# Altium schematic sheet DC-DC_Protection.SchDoc
size A4
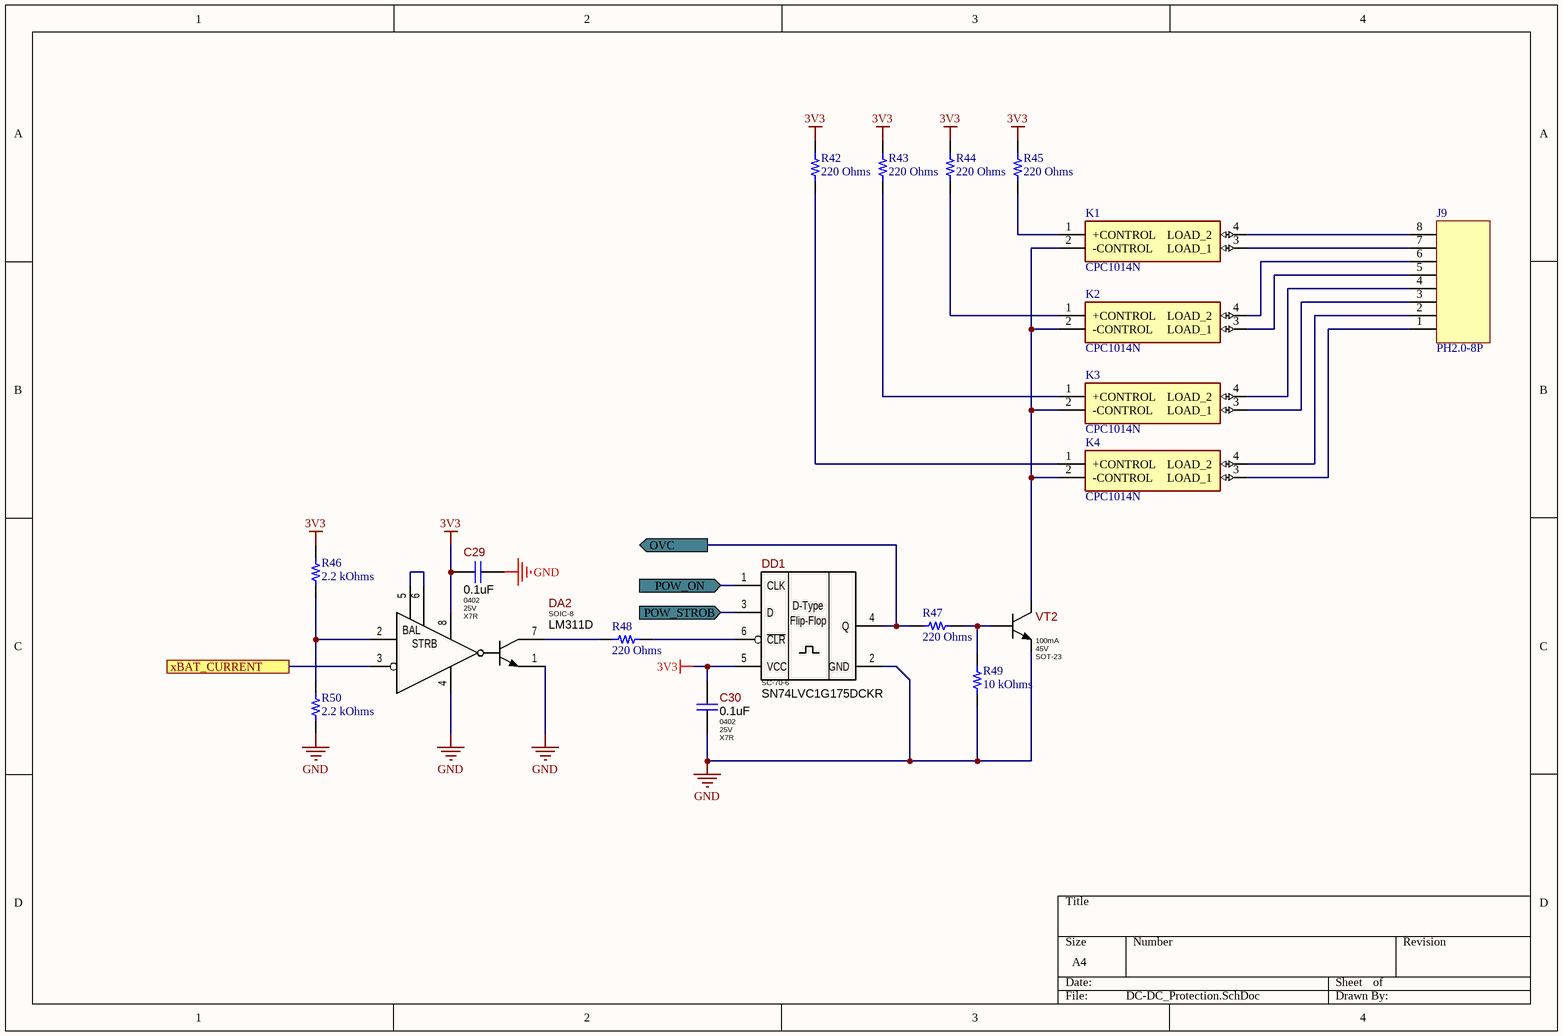
[diagram p0: DC-DC_Protection.SchDoc]

## Parts
C29  Package: 0402  Voltage: 25V  Dielectric Type: X7R  [C_CERAMIC_0402_MED]  (hidden comment: 0.1uF)
C30  Package: 0402  Voltage: 25V  Dielectric Type: X7R  [C_CERAMIC_0402_MED]  (hidden comment: 0.1uF)
DA2  Package: SOIC-8  [SOIC-8_W3.9MM]  (hidden comment: LM311D)
DD1  SN74LVC1G175DCKR  [SC-70-6]
J9  PH2.0-8P  [PH2.0-8P]
K1  CPC1014N  [SOP254P610X218-4N]
K2  CPC1014N  [SOP254P610X218-4N]
K3  CPC1014N  [SOP254P610X218-4N]
K4  CPC1014N  [SOP254P610X218-4N]
R42  220 Ohms  [RES 0805_2012]
R43  220 Ohms  [RES 0805_2012]
R44  220 Ohms  [RES 0805_2012]
R45  220 Ohms  [RES 0805_2012]
R46  2.2 kOhms  [RES 0805_2012]
R47  220 Ohms  [RES 0805_2012]
R48  220 Ohms  [RES 0805_2012]
R49  10 kOhms  [RES 0805_2012]
R50  2.2 kOhms  [RES 0805_2012]
VT2  Ic: 100mA  Vce: 45V  Package: SOT-23  [SOT-23_MED]  (hidden comment: BC847B)

## Ports
OVC (out), POW_ON (in), POW_STROB (in), xBAT_CURRENT

## Nets
3V3: C29.1 C30.1 DA2.8(VCC) DD1.5(VCC) R42.2 R43.2 R44.2 R45.2 R46.2
GND: C29.2 C30.2 DA2.1(EMIT_OUT) DA2.4(GND) DD1.2(GND) R49.1 R50.1 VT2.2(E)
OVC: DD1.4(Q) R47.1 ; port OVC
POW_ON: DD1.1(CLK) ; port POW_ON
POW_STROB: DD1.3(D) ; port POW_STROB
xBAT_CURRENT: DA2.3(IN-) ; port xBAT_CURRENT
NetDA2_2: DA2.2(IN+) R46.1 R50.2
NetDA2_5: DA2.5(BALANCE) DA2.6(BAL/STRB)
NetDA2_7: DA2.7(COL_OUT) R48.1
NetDD1_6: DD1.6(~{CLR}) R48.2
NetJ9_1: J9.1 K4.3(LOAD_1)
NetJ9_2: J9.2 K4.4(LOAD_2)
NetJ9_3: J9.3 K3.3(LOAD_1)
NetJ9_4: J9.4 K3.4(LOAD_2)
NetJ9_5: J9.5 K2.3(LOAD_1)
NetJ9_6: J9.6 K2.4(LOAD_2)
NetJ9_7: J9.7 K1.3(LOAD_1)
NetJ9_8: J9.8 K1.4(LOAD_2)
NetK1_1: K1.1(+CONTROL) R45.1
NetK1_2: K1.2(-CONTROL) K2.2(-CONTROL) K3.2(-CONTROL) K4.2(-CONTROL) VT2.3(C)
NetK2_1: K2.1(+CONTROL) R44.1
NetK3_1: K3.1(+CONTROL) R43.1
NetK4_1: K4.1(+CONTROL) R42.1
NetR47_2: R47.2 R49.2 VT2.1(B)

## Notes on the sheet
- (in symbol LM311D) BAL; STRB
- (in symbol SN74LVC1G175DCKR) D-Type; Flip-Flop

## Library data of the parts
C29 C30 = GRM155R71E104KE14D: 100nF 25V X7R ±10% 0402 Ceramic Capacitor RoHS; Manufacturer: Murata Electronics; Ajax_1C_ID: 7993; Ajax_1C_PN: 100nF 25V X7R 10% 0402 GRM155R71E104KE14D Ceramic Capacitor SMD RoHS; Standard Lead Time: 15 Weeks; Replacement: NONE; Value: 0.1uF; Part Number: GRM155R71E104KE14D; Lifecycle: Mass Production; Part Type: Ceramic / X7R / 0402; Component Type: SMD; Temperature Range: -55°C ~ 125°C; Tolerance: ±10%; ComponentLink1URL: https://search.murata.co.jp/Ceramy/image/img/A01X/G101/ENG/GRM155R71E104KE14-01.pdf; Supplier 1: Digi-Key; Supplier Part Number 1: 490-10698-1-ND; ComponentLink1Description: Datasheet
DA2 = LM311D: Differential General Purpose Comparator with Open-Collector, Open-Emitter, SOIC-8; Manufacturer: Texas Instruments; Ajax_1C_ID: 11065; Ajax_1C_PN: LM311D SO8, микросхема; Ajax_1С_Status: RND Only; Standard Lead Time: 6 Weeks; Component Status: On Review; Replacement: NONE; GUID_1C: 9c0f62f0-bfd1-11e7-8199-14dda9d2d04d; Part Number: LM311D; Part Type: Comparator; Component Type: SMD; Temperature Range: 0°C ~ 70°C; ComponentLink1URL: https://www.ti.com/lit/ds/symlink/lm311.pdf; Supplier 1: Digi-Key; Supplier Part Number 1: 296-1388-5-ND; Price: 0.15; ComponentLink1Description: Datasheet
DD1 = SN74LVC1G175DCKR: Single D-type Flip-Flop with Asynchronous Clear, Positive Edge Trigger, SC-70-6; Manufacturer: Texas Instruments; Ajax_1C_ID: 25389; Ajax_1C_PN: SN74LVC1G175DCKR (SC70-6) микросхема; Standard Lead Time: 6 Weeks; Replacement: NONE; Package: SC-70-6; Part Number: SN74LVC1G175DCKR; Part Type: Logic; Component Type: SMD; Lifecycle: RND Only; Temperature Range: -40°C ~ 125°C; ComponentLink1URL: https://www.ti.com/lit/ds/symlink/sn74lvc1g175.pdf?HQS=dis-dk-null-digikeymode-dsf-pf-null-wwe&ts=1622018232841; Supplier 1: Digi-Key; Supplier Part Number 1: 296-16998-2-ND; ComponentLink1Description: Datasheet
K1-K4 = CPC1014N: Relay or Contactor; Manufacturer_Name: LITTELFUSE; Datasheet Link: https://datasheet.datasheetarchive.com/originals/distributors/Datasheets-DGA15/691004.pdf; Height: 2.184mm; Manufacturer_Part_Number: CPC1014N; Mouser Part Number: 849-CPC1014N; Mouser Price/Stock: https://www.mouser.co.uk/ProductDetail/IXYS-Integrated-Circuits/CPC1014N?qs=OpMkDkHXivPNK7%252BhCXwefA%3D%3D; Arrow Part Number: CPC1014N; Arrow Price/Stock: https://www.arrow.com/en/products/cpc1014n/ixys
R42-R45 R47 = ESR10EZPF2200: RES SMD 220 OHM 1% 0.4W 0805; Manufacturer: Rohm Semiconductor; Power (Watts): 0.4W, 2/5W; Temperature Coefficient: ±100ppm/°C; Part Number: ESR10EZPF2200; Value: 220 Ohms; ComponentLink1Description: Datasheet; ComponentLink1URL: https://www.rohm.com/datasheet/ESR01MZPF/esr-e; ComponentLink2Description: DigiKey Link; ComponentLink2URL: http://digikey.com/product-detail/en/rohm-semiconductor/ESR10EZPF2200/RHM220AECT-ND/1983835; Composition: Thick Film; Device Package: 0805 (2012 Metric); Features: Automotive AEC-Q200, Pulse Withstanding; Height - Seated (Max): 0.026" (0.65mm); LastUpdated: 02.09.2020 01:15:23; Lifecycle Status: Active; Minimum Order: 1; Number of Terminations: 2; Operating Temperature: -55°C ~ 155°C; Package / Case: 0805 (2012 Metric); Packaging: TapeAndReel; PartId: 28037; Part Status: Active; Price: 0.02; Ratings: AEC-Q200; Resistance: 220 Ohms; Series: ESR; Size / Dimension: 0.079" L x 0.049" W (2.00mm x 1.25mm); Supplier 1: DigiKey; Supplier Part Number 1: RHM220AECT-ND; Supplier Device Package: 0805; Tolerance: ±1%
R46 R50 = SR0805JR-7W2K2L: RES SMD 2.2K OHM 5% 1/4W 0805; Manufacturer: Yageo; Power (Watts): 0.25W, 1/4W; Temperature Coefficient: ±200ppm/°C; Part Number: SR0805JR-7W2K2L; Value: 2.2 kOhms; ComponentLink1Description: Datasheet; ComponentLink1URL: http://www.yageo.com/documents/recent/PYu-SR_20105_RoHS_L_8.pdf; ComponentLink2Description: DigiKey Link; ComponentLink2URL: http://digikey.com/product-detail/en/yageo/SR0805JR-7W2K2L/YAG6054CT-ND/9696508; Composition: Thick Film; Device Package: 0805 (2012 Metric); Features: Automotive AEC-Q200, Pulse Withstanding; Height - Seated (Max): 0.024" (0.60mm); LastUpdated: 02.09.2020 01:15:24; Lifecycle Status: Active; Minimum Order: 1; Number of Terminations: 2; Operating Temperature: -55°C ~ 155°C; Package / Case: 0805 (2012 Metric); Packaging: TapeAndReel; PartId: 27793; Part Status: Active; Price: 0.03; Ratings: AEC-Q200; Resistance: 2.2 kOhms; Series: SR; Size / Dimension: 0.079" L x 0.049" W (2.00mm x 1.25mm); Supplier 1: DigiKey; Supplier Part Number 1: YAG6054CT-ND; Supplier Device Package: 0805; Tolerance: ±5%
R48 = CRGP0805F220R: CRGP 0805 220R 1%; Manufacturer: TE Connectivity Passive Product; Power (Watts): 0.333W, 1/3W; Temperature Coefficient: ±100ppm/°C; Part Number: CRGP0805F220R; Value: 220 Ohms; ComponentLink1Description: Datasheet; ComponentLink1URL: https://www.te.com/commerce/DocumentDelivery/DDEController?Action=srchrtrv&DocNm=9-1773463-9&DocType=DS&DocLang=English; ComponentLink2Description: DigiKey Link; ComponentLink2URL: http://digikey.com/product-detail/en/te-connectivity-passive-product/CRGP0805F220R/A130469CT-ND/8578301; Composition: Thick Film; Device Package: 0805 (2012 Metric); Features: Pulse Withstanding; Height - Seated (Max): 0.026" (0.65mm); LastUpdated: 02.09.2020 01:15:22; Lifecycle Status: Active; Minimum Order: 1; Number of Terminations: 2; Operating Temperature: -55°C ~ 155°C; Package / Case: 0805 (2012 Metric); Packaging: TapeAndReel; PartId: 28799; Part Status: Active; Price: 0.02; Resistance: 220 Ohms; Series: CRGP; Size / Dimension: 0.079" L x 0.049" W (2.00mm x 1.25mm); Supplier 1: DigiKey; Supplier Part Number 1: A130469CT-ND; Supplier Device Package: 0805; Tolerance: ±1%
R49 = RNCS0805BKE10K0: RES 10K OHM 0.1% 1/10W 0805; Manufacturer: Stackpole Electronics Inc; Power (Watts): 0.1W, 1/10W; Temperature Coefficient: ±25ppm/°C; Part Number: RNCS0805BKE10K0; Value: 10 kOhms; ComponentLink1Description: Datasheet; ComponentLink1URL: https://www.seielect.com/catalog/sei-rncs_rnch.pdf; ComponentLink2Description: DigiKey Link; ComponentLink2URL: http://digikey.com/product-detail/en/stackpole-electronics-inc/RNCS0805BKE10K0/RNCS0805BKE10K0CT-ND/1800164; Composition: Thin Film; Device Package: 0805 (2012 Metric); Features: Anti-Corrosive, Automotive AEC-Q200, Moisture Resistant; Height - Seated (Max): 0.026" (0.65mm); LastUpdated: 02.09.2020 01:15:24; Lifecycle Status: Active; Minimum Order: 1; Number of Terminations: 2; Operating Temperature: -55°C ~ 155°C; Package / Case: 0805 (2012 Metric); Packaging: TapeAndReel; PartId: 27713; Part Status: Active; Price: 0.09; Ratings: AEC-Q200; Resistance: 10 kOhms; Series: RNCS; Size / Dimension: 0.079" L x 0.049" W (2.00mm x 1.25mm); Supplier 1: DigiKey; Supplier Part Number 1: RNCS0805BKE10K0CT-ND; Supplier Device Package: 0805; Tolerance: ±0.1%
VT2 = BC847B,215: 45V, 100mA NPN General Purpose Transistor; Manufacturer: Nexperia USA Inc.; Ajax_1C_PN: NONE; Standard Lead Time: 4 Weeks; Part Type: NPN; Component Type: SMD; Lifecycle: RND Only; Temperature Range: -65°C ~ 150°C; ComponentLink1URL: https://assets.nexperia.com/documents/data-sheet/BC847_SER.pdf; Supplier 1: Digi-Key; Supplier Part Number 1: 1727-2921-2-ND; Replacement: NONE; ComponentLink1Description: Datasheet